# Altium schematic sheet mojo_sch.SchDoc
size A4
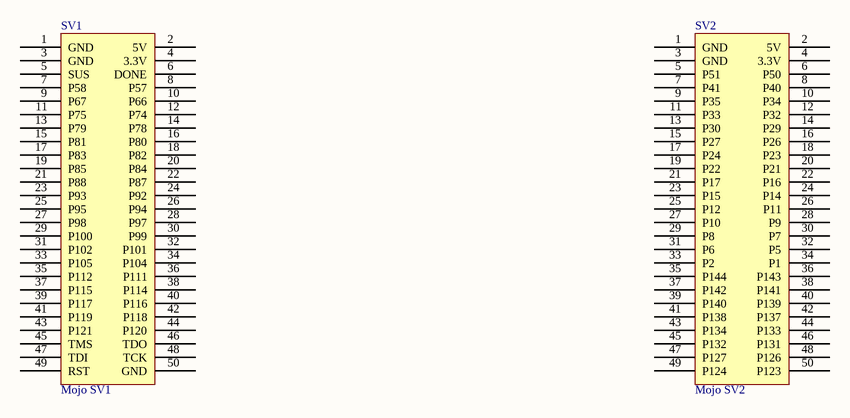
[diagram p0: mojo_sch.SchDoc]

## Parts
SV1  Mojo SV1  [PH25X2]
SV2  Mojo SV2  [PH25X2]

## Nets

Not connected (* = marked no-connect by the designer): SV1 1(GND) 2(5V) 3(GND) 4(3.3V) 5(SUS) 6(DONE) 7(P58) 8(P57) 9(P67) 10(P66) 11(P75) 12(P74) 13(P79) 14(P78) 15(P81) 16(P80) 17(P83) 18(P82) 19(P85) 20(P84) 21(P88) 22(P87) 23(P93) 24(P92) 25(P95) 26(P94) 27(P98) 28(P97) 29(P100) 30(P99) 31(P102) 32(P101) 33(P105) 34(P104) 35(P112) 36(P111) 37(P115) 38(P114) 39(P117) 40(P116) 41(P119) 42(P118) 43(P121) 44(P120) 45(TMS) 46(TDO) 47(TDI) 48(TCK) 49(RST) 50(GND); SV2 1(GND) 2(5V) 3(GND) 4(3.3V) 5(P51) 6(P50) 7(P41) 8(P40) 9(P35) 10(P34) 11(P33) 12(P32) 13(P30) 14(P29) 15(P27) 16(P26) 17(P24) 18(P23) 19(P22) 20(P21) 21(P17) 22(P16) 23(P15) 24(P14) 25(P12) 26(P11) 27(P10) 28(P9) 29(P8) 30(P7) 31(P6) 32(P5) 33(P2) 34(P1) 35(P144) 36(P143) 37(P142) 38(P141) 39(P140) 40(P139) 41(P138) 42(P137) 43(P134) 44(P133) 45(P132) 46(P131) 47(P127) 48(P126) 49(P124) 50(P123)

## Library data of the parts
SV1 = SV1
SV2 = SV2